# Altium schematic sheet DAC4-20mA-ADC-0-10V.SchDoc
size A
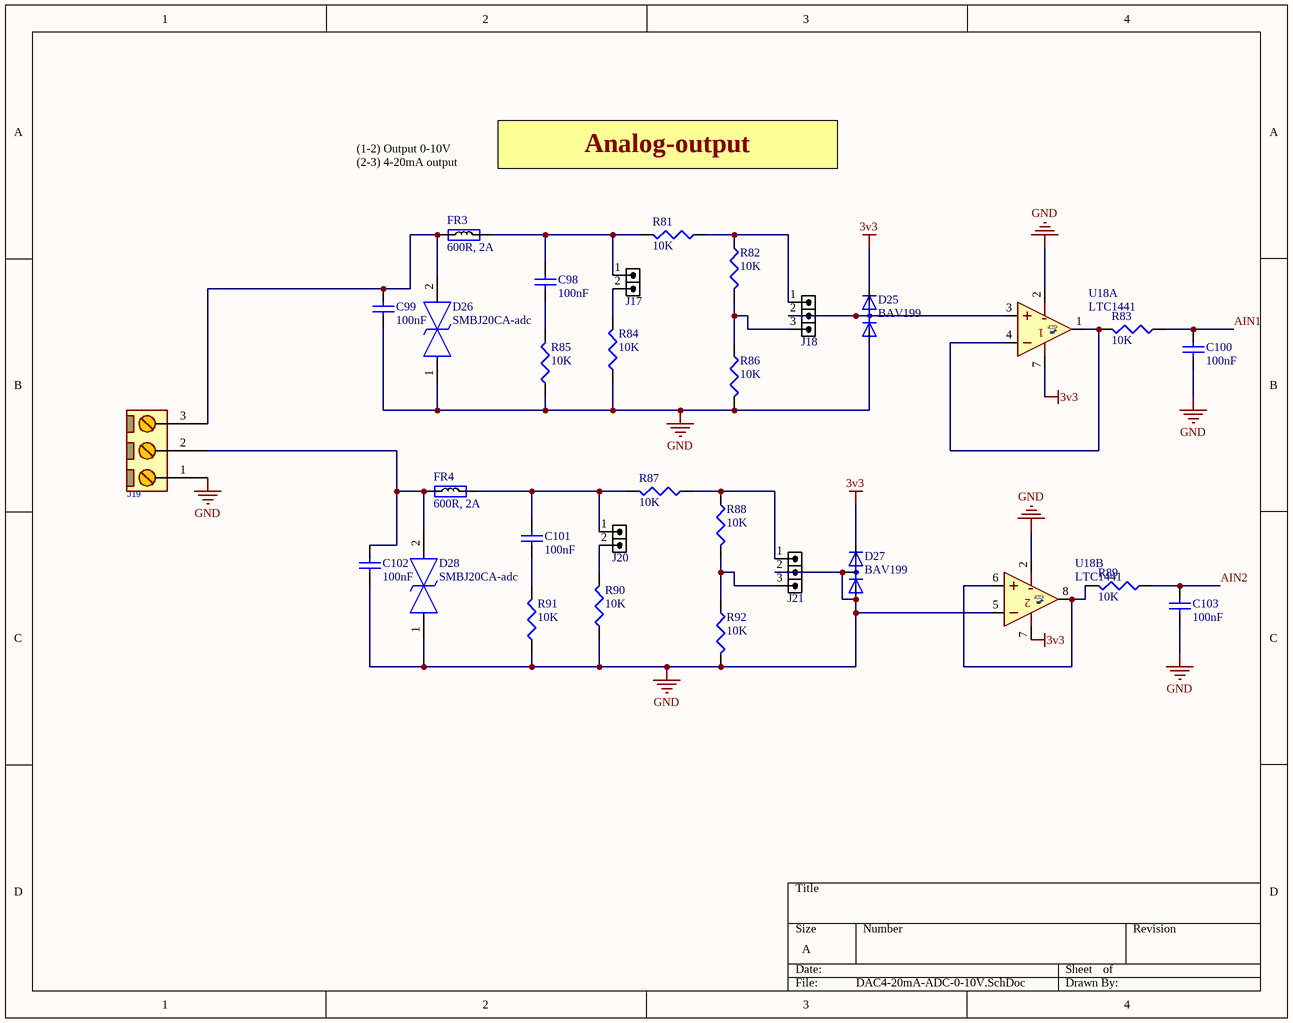
[diagram p0: DAC4-20mA-ADC-0-10V.SchDoc]

## Parts
C98  100nF  [c0603]
C99  100nF  [c0603]
C100  100nF  [c0603]
C101  100nF  [c0603]
C102  100nF  [c0603]
C103  100nF  [c0603]
D25  BAV199  [SOT323_3]
D26  SMBJ20CA-adc  [ESD_XDFN2]
D27  BAV199  [SOT323_3]
D28  SMBJ20CA-adc  [ESD_XDFN2]
FR3  600R, 2A  [RES0805]
FR4  600R, 2A  [RES0805]
J17  HDRM2  [HDR_M_1X2]  (value not drawn)
J18  HDRM3  [HDR_M_1X3]  (value not drawn)
J19  CONN_TB3  [MSTB_3]  (value not drawn)
J20  HDRM2  [HDR_M_1X2]  (value not drawn)
J21  HDRM3  [HDR_M_1X3]  (value not drawn)
R81  10K  [RES 0603_1608]
R82  10K  [RES 0603_1608]
R83  10K  [RES 0603_1608]
R84  10K  [RES 0603_1608]
R85  10K  [RES 0603_1608]
R86  10K  [RES 0603_1608]
R87  10K  [RES 0603_1608]
R88  10K  [RES 0603_1608]
R89  10K  [RES 0603_1608]
R90  10K  [RES 0603_1608]
R91  10K  [RES 0603_1608]
R92  10K  [RES 0603_1608]
U18  LTC1441  [SO_8]  (parts A,B of 2)

## Nets
3v3: D25.2(C) D27.2(C) U18.7(V+)
GND: C99.1 C100.1 C102.1 C103.1 D25.1(A) D26.1 D27.1(A) D27.3(AC) D28.1 J19.1 J21.2 R84.1 R85.1 R86.2 R90.1 R91.1 R92.2 U18.2(V-) U18.5(IN-)
AIN1: C100.2 R83.1
AIN2: C103.2 R89.1
NetC98_1: C98.1 R85.2
NetC98_2: C98.2 FR3.2 J17.1 R81.2
NetC99_2: C99.2 D26.2 FR3.1 J19.3
NetC101_1: C101.1 R91.2
NetC101_2: C101.2 FR4.2 J20.1 R87.2
NetC102_2: C102.2 D28.2 FR4.1 J19.2
NetD25_3: D25.3(AC) J18.2 U18.3(IN+)
NetJ17_2: J17.2 R84.2
NetJ18_1: J18.1 R81.1 R82.1
NetJ18_3: J18.3 R82.2 R86.1
NetJ20_2: J20.2 R90.2
NetJ21_1: J21.1 R87.1 R88.1
NetJ21_3: J21.3 R88.2 R92.1
NetR83_2: R83.2 U18.1(OUT) U18.4(IN-)
NetR89_2: R89.2 U18.6(IN+) U18.8(OUT)

## Notes on the sheet
- Analog-output
- (1-2) Output 0-10V
  (2-3) 4-20mA output

## Library data of the parts
C98-C103 = Cap Semi: 0.10µF 50V Ceramic Capacitor X7R 0603; Manufacturer Part Number: CL10B104KB8SFNC; Digi-Key Part Number: 1276-1936-1-ND; Value: 100nF
D25 D27 = BAV199: Diode Array 1 Pair Series Connection Standard 85V 140mA _DC_ Surface Mount TO-236-3, SC-59, SOT-23-3; MF: Diodes; Value: *; MP: BAV199; Package: SOT-23 Infineon; SnapEDA_Link: https://www.snapeda.com/parts/BAV199/Diodes%20Inc./view-part/193783/?ref=snap; Price: None; Availability: Unavailable
D26 D28 = SMBJ20CA-adc: TVS Diode (Bi-directional); Manufacturer_Name: onsemi; Datasheet Link: https://componentsearchengine.com/Datasheets/1/SMBJ20CA.pdf; Height: 2.45mm; Manufacturer_Part_Number: SMBJ20CA; Mouser Part Number: 512-SMBJ20CA; Mouser Price/Stock: https://www.mouser.co.uk/ProductDetail/onsemi-Fairchild/SMBJ20CA?qs=iN0KuJO79Ka3il%2FXEzRA3A%3D%3D; Arrow Part Number: SMBJ20CA; Arrow Price/Stock: https://www.arrow.com/en/products/smbj20ca/on-semiconductor
FR3 FR4 = Ferrite: Manufacturer Part Number 1: MPZ2012S601AT000; Manufacturer: TDK Corporation; Part Description: FERRITE BEAD 600 OHM 0805 1LN; DC Resistance (DCR): 100 mOhm Max; Filter Type: Differential Mode - Single; Impedance @ Frequency: 600 Ohm @ 100MHz; Supplier 1: Digi-Key; Supplier Part Number 1: 445-2206-2-ND; Value: 600R, 2A; Category: Filters; Current Rating: 2A; Height (Max): 0.041" (1.05mm); Mounting Type: Surface Mount; Package / Case: 0805 (2012 Metric); Packaging: Tape & Reel (TR); RoHS: RoHS Compliant; Size / Dimension: 0.079" L x 0.049" W (2.00mm x 1.25mm)
J17 J20 = HDR_M_1X2: CONN, HEADER, Male, pitch: 2.54mm, 2POS; VALUE: HDRM2
J18 J21 = HDR_M_1X3: CONN, HEADER, Male, pitch: 2.54mm, 3POS; VALUE: HDRM3
J19 = CONN_MSTB_3: CONN, PHOENIX MSTB, 5-G, 5.08mm pitch; VALUE: CONN_TB3
R81-R92 = Res3_1: RES SMD 10K OHM 1% 1/10W 0603; Manufacturer Part Number: RC1608F103CS; Digi-Key Part Number: 1276-3485-1-ND; Value: 10K
U18 = LTC1441_SOP8: Comparator, Dual, Ultralow Power, with Reference; MANF: Linear Technology; MANF_P#: LTC1441CS8, LTC1441IS8; PARAM2: 2.7~16V, ±1.35~8V; VALUE: LTC1441